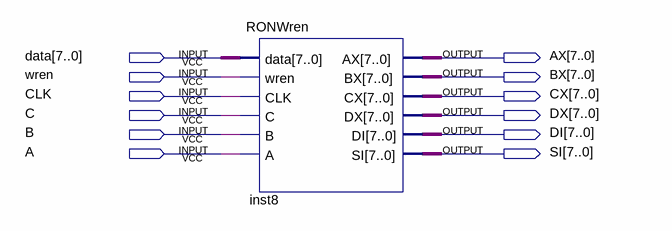
[diagram p0: schematic sheet]
// Quartus schematic test.bdf as structural Verilog: 1 symbols, 12 pins
module test (
  input  [7:0] data,
  input  wren,
  input  CLK,
  input  C,
  input  B,
  input  A,
  output [7:0] AX,
  output [7:0] BX,
  output [7:0] CX,
  output [7:0] DX,
  output [7:0] DI,
  output [7:0] SI
);

  RONWren inst8 (
    .data(data), .wren(wren), .CLK(CLK), .C(C), .B(B), .A(A), .AX(AX), .BX(BX), .CX(CX), .DX(DX), .DI(DI),
    .SI(SI));
endmodule
